# EasyEDA Pro project Control Panel PCB.eprj

# Schematic Schematic1
Board Name: Board1; Create Date: 2025-07-27; Page Name: P1; Project Name: Control Panel PCB; Schematic Name: Schematic1; Update Date: 2025-07-27; Company: EasyEDA.com; Page Size: A4; Version: V1.0
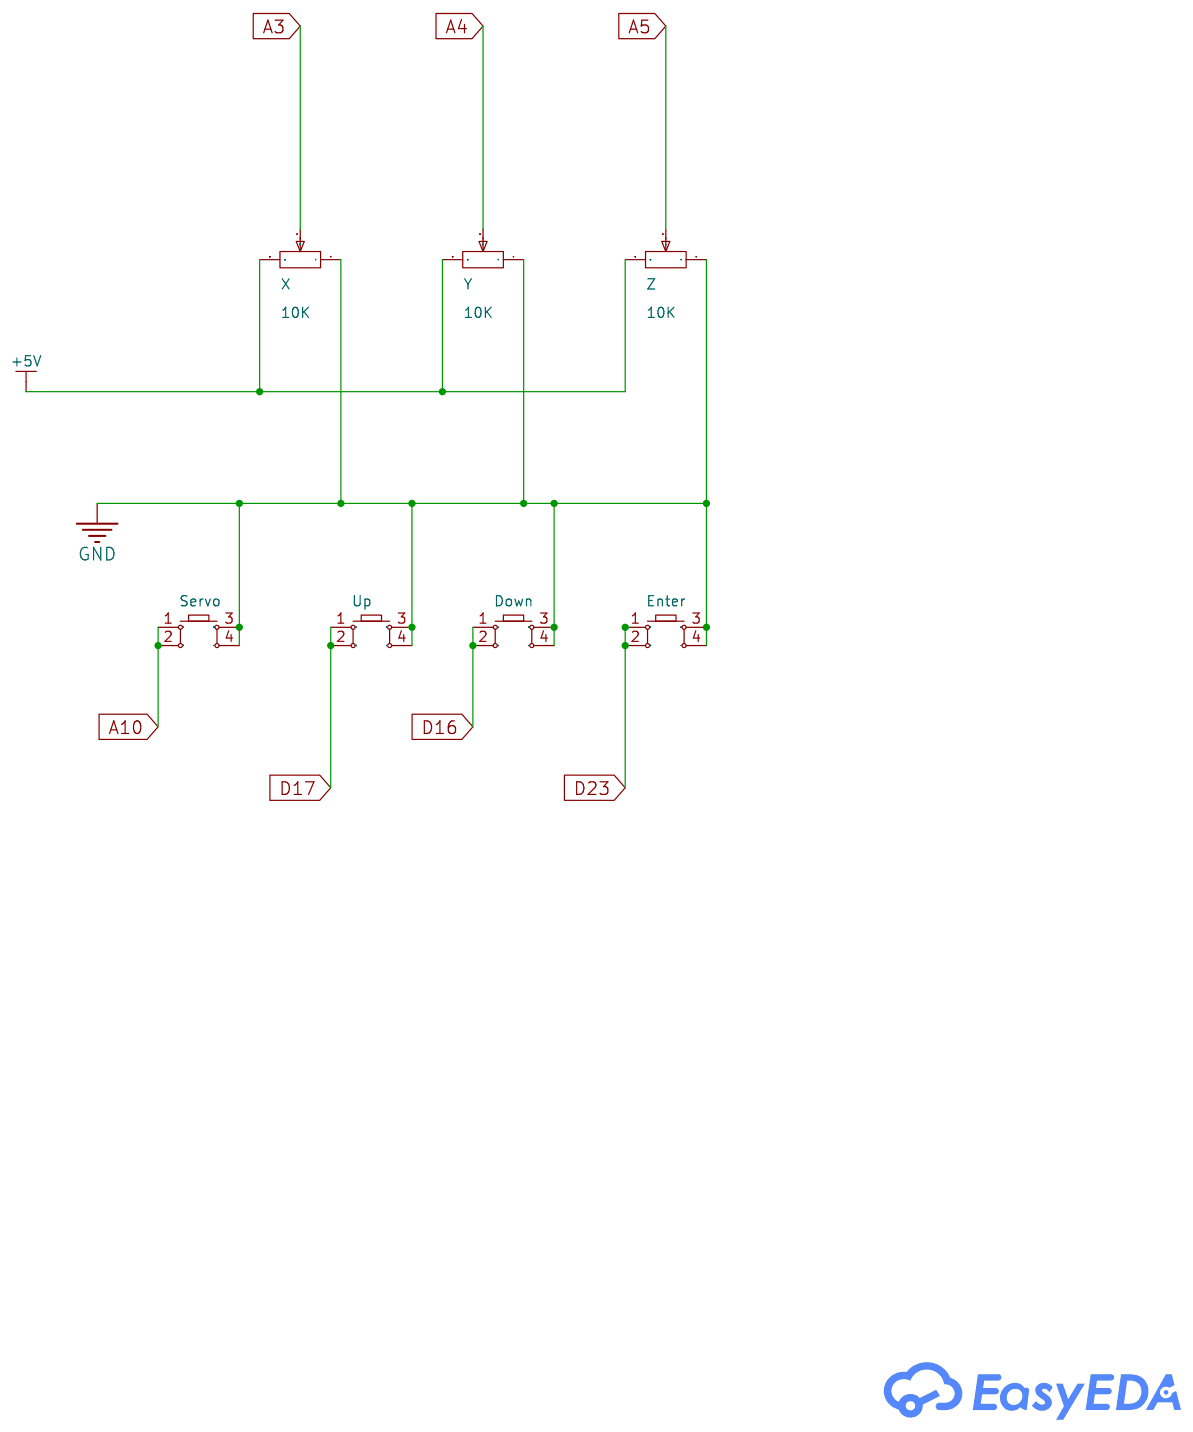
[diagram p0: schematic sheet]

## Parts
Down  -  [KEY-TH_4P-L6.0-W6.0-P3.90-LS6.5]
Enter  -  [KEY-TH_4P-L6.0-W6.0-P3.90-LS6.5]
Servo  -  [KEY-TH_4P-L6.0-W6.0-P3.90-LS6.5]
Up  -  [KEY-TH_4P-L6.0-W6.0-P3.90-LS6.5]
X  10K  [RES-ADJ-TH_3P-L9.5-W9.5-P2.54-BR-BS]
Y  10K  [RES-ADJ-TH_3P-L9.5-W9.5-P2.54-BR-BS]
Z  10K  [RES-ADJ-TH_3P-L9.5-W9.5-P2.54-BR-BS]

## Library data of the parts
Down Enter Servo Up = Key_TH_6x6x4.5: Supplier Footprint: Through
X Y Z = R_3386P: Supplier Footprint: Through

## Nets
+5V: X.3 Y.3 Z.3
GND: Down.3 Down.4 Enter.3 Enter.4 Servo.3 Servo.4 Up.3 Up.4 X.1 Y.1 Z.1
A3: X.2
A4: Y.2
A5: Z.2
A10: Servo.1 Servo.2
D16: Down.1 Down.2
D17: Up.1 Up.2
D23: Enter.1 Enter.2

# Board PCB1
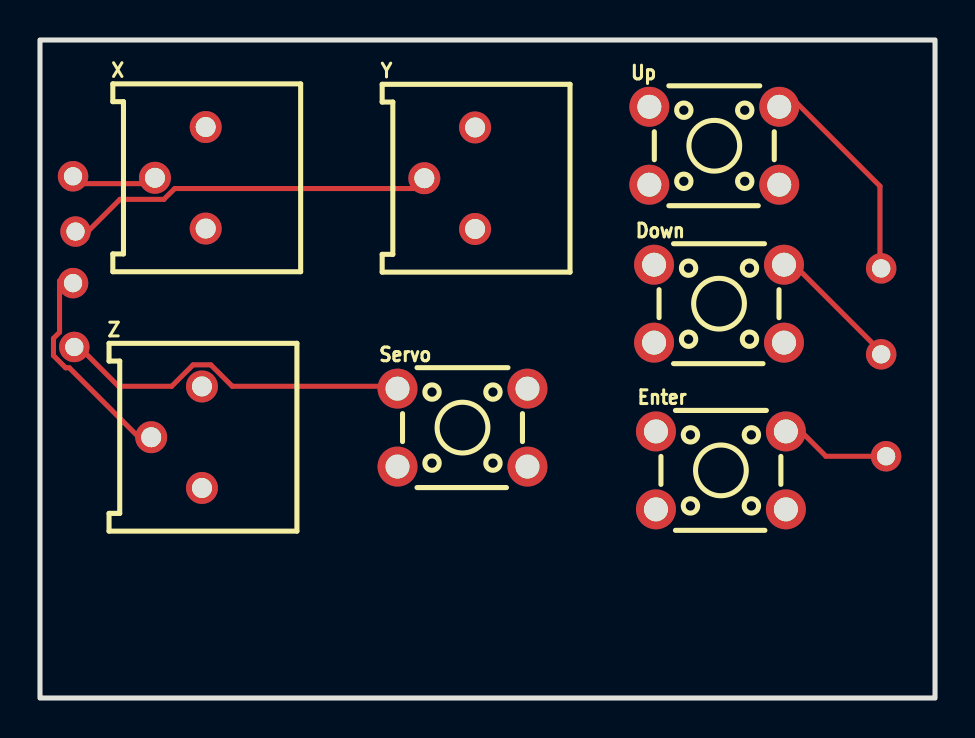
[diagram p1: board, top side]
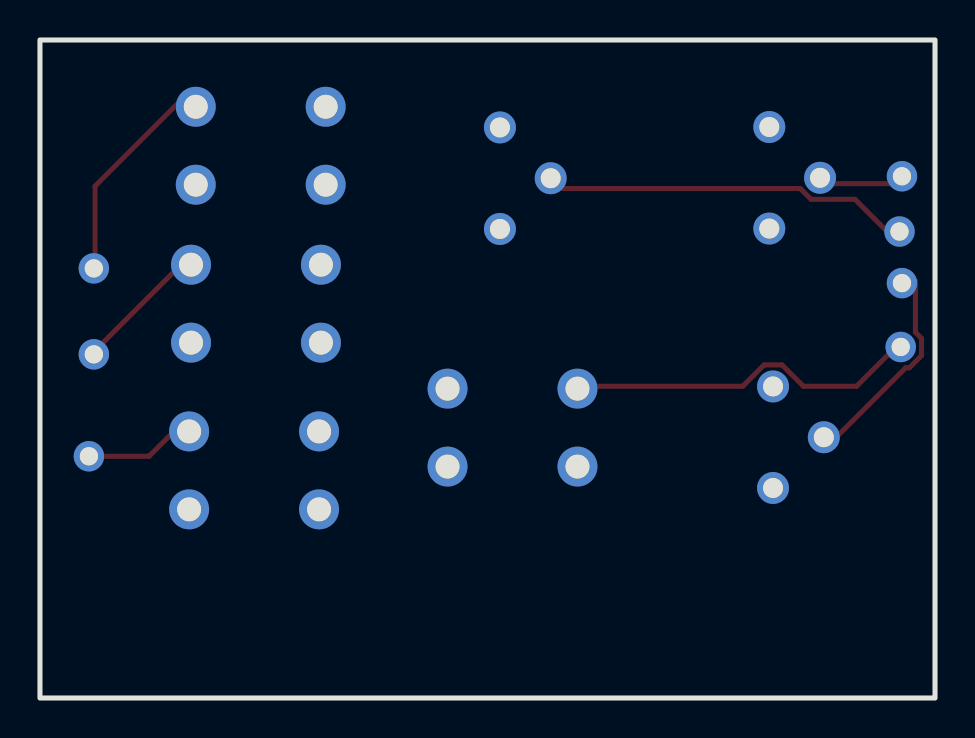
[diagram p2: board, bottom side, seen from below]

Outline 44.78 x 32.93 mm; copper layers: Top Layer, Bottom Layer. Coordinates in mm from the lower left corner of the outline.
Outline path: rectangle 0,32.93 44.78,0
Stack: Top Layer 0.035mm / Dielectric1 1.51mm FR4 er 4.5 / Bottom Layer 0.035mm

## Design rules (mm)
template: JLCPCB Capability(Two Layers Board)
spacing copperThickness1oz (default): track to track 0.102, other pairs 0.152 to 0.3
spacing copperThickness2oz: track to track 0.203, other pairs 0.152 to 0.3
track width copperThickness1oz (default): min 0.127, default 0.254, max 2.54
track width copperThickness2oz: min 0.203, default 0.254, max 2.54
differential pair differentialPair (default): width min 0.127, default 0.254, max 2.54; gap min 0.152, default 0.152
via viaSize (default): diameter min 0.5, default 0.61, max 10; hole min 0.3, default 0.305, max 6.3

## Placement (name value [footprint] x y rotation side)
Down  -  [KEY-TH_4P-L6.0-W6.0-P3.90-LS6.5]  33.97 19.73 0 top
Enter  -  [KEY-TH_4P-L6.0-W6.0-P3.90-LS6.5]  34.07 11.39 0 top
NOREF  -  [Pad_e26]  42.08 21.5 0 top
NOREF#2  -  [Pad_e28]  42.33 12.1 0 top
NOREF#3  -  [Pad_e27]  42.08 17.2 0 top
NOREF#4  -  [Pad_e23]  1.78 23.34 0 top
NOREF#5  -  [Pad_e24]  1.65 20.76 0 top
NOREF#6  -  [Pad_e25]  1.72 17.57 0 top
NOREF#7  -  [Pad_e22]  1.65 26.11 0 top
Servo  -  [KEY-TH_4P-L6.0-W6.0-P3.90-LS6.5]  21.14 13.53 0 top
Up  -  [KEY-TH_4P-L6.0-W6.0-P3.90-LS6.5]  33.73 27.63 0 top
X  10K  [RES-ADJ-TH_3P-L9.5-W9.5-P2.54-BR-BS]  7.02 26.03 0 top
Y  10K  [RES-ADJ-TH_3P-L9.5-W9.5-P2.54-BR-BS]  20.5 26.01 0 top
Z  10K  [RES-ADJ-TH_3P-L9.5-W9.5-P2.54-BR-BS]  6.83 13.05 0 top

## Footprints (pads in the part's own frame, mm; a bottom-side part is the same pattern mirrored in y, then rotated)
KEY-TH_4P-L6.0-W6.0-P3.90-LS6.5
  round 2 hole 1.2: 1(-3.25,1.95) 2(3.25,1.95) 3(-3.25,-1.95) 4(3.25,-1.95)
Pad_e22
  round 1.524 hole 0.914: 1(0,0)
Pad_e23
  round 1.524 hole 0.914: 2(0,0)
Pad_e24
  round 1.524 hole 0.914: 3(0,0)
Pad_e25
  round 1.524 hole 0.914: 4(0,0)
Pad_e26
  round 1.524 hole 0.914: 5(0,0)
Pad_e27
  round 1.524 hole 0.914: 6(0,0)
Pad_e28
  round 1.524 hole 0.914: 7(0,0)
RES-ADJ-TH_3P-L9.5-W9.5-P2.54-BR-BS
  round 1.6 hole 1: 1(1.27,-2.54) 2(-1.27,0) 3(1.27,2.54)

## Nets
+5V: X.3 Y.3 Z.3
GND: Down.3 Down.4 Enter.3 Enter.4 Servo.3 Servo.4 Up.3 Up.4 X.1 Y.1 Z.1
A3: NOREF#7.1 X.2
A4: NOREF#4.2 Y.2
A5: NOREF#5.3 Z.2
A10: NOREF#6.4 Servo.1 Servo.2
D16: Down.1 Down.2 NOREF#3.6
D17: NOREF.5 Up.1 Up.2
D23: Enter.1 Enter.2 NOREF#2.7

## Routing (per net, layer and track width the routed paths; a pad name or vN(x,y) marks a point on that pad's centre or on a via; arc(x,y) is an arc through that point)
A3: length 3.6
  Top Layer w0.254: 5.77,25.74 2.27,25.74 2.21,25.8
A4: length 18.4
  Top Layer w0.254: 19.6,25.49 6.74,25.49 6.2,24.95 4,24.95 2.21,23.16
A5: length 10.6
  Top Layer w0.254: 0.98,20.88 0.98,18.3 0.67,18 0.67,17.13 1.28,16.52 1.47,16.52 5.46,12.53
A10: length 17.8
  Top Layer w0.254: 1.84,17.69 3.93,15.6 6.59,15.6 7.66,16.67 8.55,16.67 9.62,15.6 17.88,15.6
D16: length 5.6
  Top Layer w0.254: 41.65,17.75 37.97,21.44 37.97,21.87
D17: length 9.7
  Top Layer w0.254: 42.02,22.05 42.02,25.61 37.66,29.98
D23: length 4.5
  Top Layer w0.254: 41.78,12.1 39.32,12.1 37.85,13.57
